# EAGLE design R107S1A (EAGLE 6.6.0)
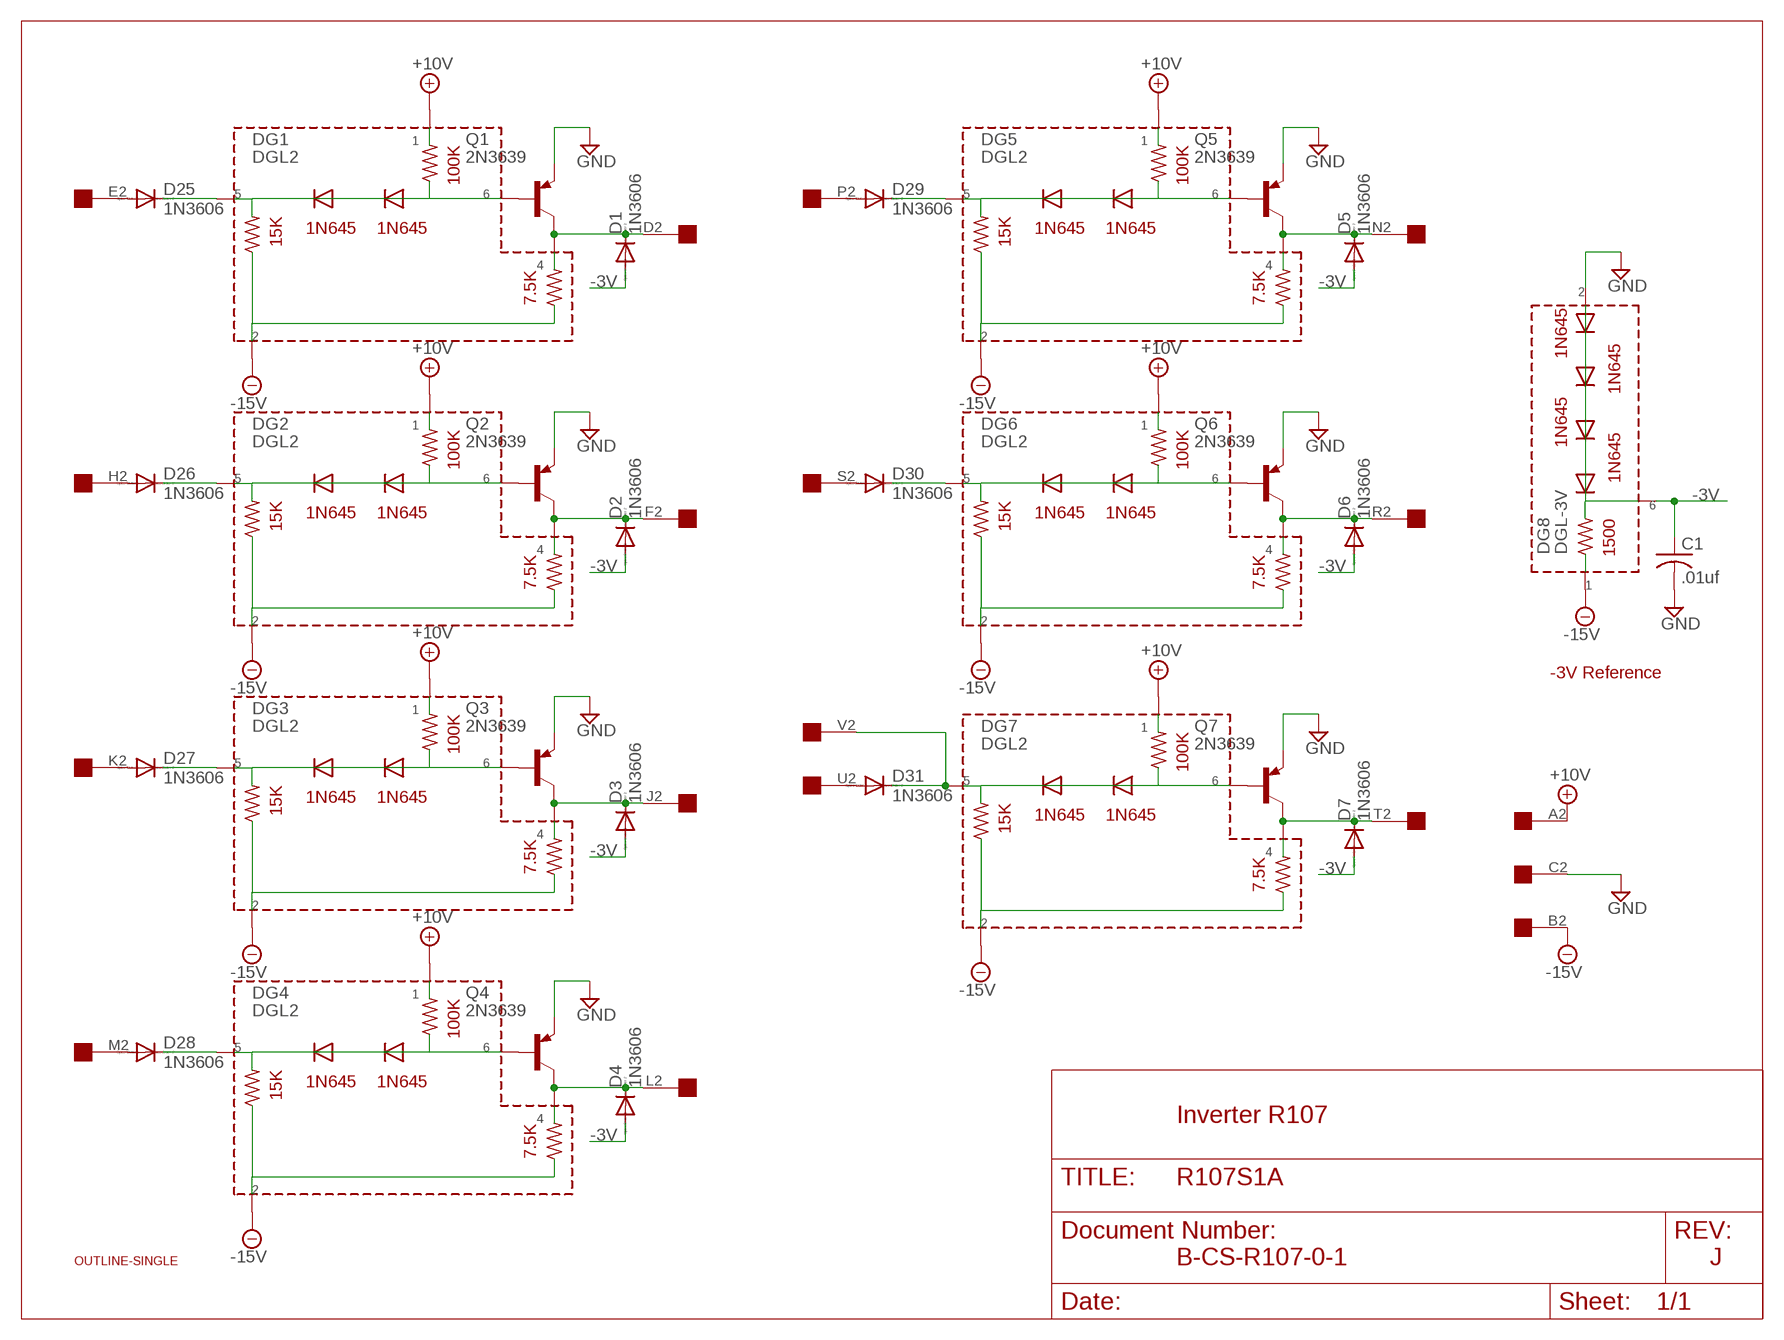
[diagram p0: schematic, sheet 1]

## Parts
C1  .01uf  C-US050-025X075  [C050-025X075]
D1  1N3606  1N4148DO35-10  [DO35-10]
D2  1N3606  1N4148DO35-10  [DO35-10]
D3  1N3606  1N4148DO35-10  [DO35-10]
D4  1N3606  1N4148DO35-10  [DO35-10]
D5  1N3606  1N4148DO35-10  [DO35-10]
D6  1N3606  1N4148DO35-10  [DO35-10]
D7  1N3606  1N4148DO35-10  [DO35-10]
D25  1N3606  1N4148DO35-10  [DO35-10]
D26  1N3606  1N4148DO35-10  [DO35-10]
D27  1N3606  1N4148DO35-10  [DO35-10]
D28  1N3606  1N4148DO35-10  [DO35-10]
D29  1N3606  1N4148DO35-10  [DO35-10]
D30  1N3606  1N4148DO35-10  [DO35-10]
D31  1N3606  1N4148DO35-10  [DO35-10]
DG1  DGL2  [DGL2]
DG2  DGL2  [DGL2]
DG3  DGL2  [DGL2]
DG4  DGL2  [DGL2]
DG5  DGL2  [DGL2]
DG6  DGL2  [DGL2]
DG7  DGL2  [DGL2]
DG8  DGL-3V  [DGL2]
Q1  2N3639  2N3637  [TO39]
Q2  2N3639  2N3637  [TO39]
Q3  2N3639  2N3637  [TO39]
Q4  2N3639  2N3637  [TO39]
Q5  2N3639  2N3637  [TO39]
Q6  2N3639  2N3637  [TO39]
Q7  2N3639  2N3637  [TO39]
U$1  OUTLINE-SINGLE  [SINGLE]
U$2  EDGE-1  [EDGE-CON1]

## Nets
+10V [Power]: DG1.P$1 DG2.P$1 DG3.P$1 DG4.P$1 DG5.P$1 DG6.P$1 DG7.P$1 U$2.A2
-3V [Power]: C1.1 D1.A D2.A D3.A D4.A D5.A D6.A D7.A DG8.P$6
-15V [Power]: DG1.P$2 DG2.P$2 DG3.P$2 DG4.P$2 DG5.P$2 DG6.P$2 DG7.P$2 DG8.P$1 U$2.B2
GND [Power]: C1.2 DG8.P$2 Q1.1(E) Q2.1(E) Q3.1(E) Q4.1(E) Q5.1(E) Q6.1(E) Q7.1(E) U$2.C2
N$1: D7.C DG7.P$4 Q7.3(C) U$2.T2
N$2: DG2.P$6 Q2.2(B)
N$4: D2.C DG2.P$4 Q2.3(C) U$2.F2
N$5: D26.A U$2.H2
N$6: DG3.P$6 Q3.2(B)
N$7: DG4.P$6 Q4.2(B)
N$8: D26.C DG2.P$5
N$9: D3.C DG3.P$4 Q3.3(C) U$2.J2
N$10: D27.A U$2.K2
N$11: D27.C DG3.P$5
N$12: D28.C DG4.P$5
N$14: D31.A U$2.U2
N$15: DG5.P$6 Q5.2(B)
N$17: D31.C DG7.P$5 U$2.V2
N$18: DG6.P$6 Q6.2(B)
N$19: DG1.P$6 Q1.2(B)
N$20: D1.C DG1.P$4 Q1.3(C) U$2.D2
N$21: D25.A U$2.E2
N$22: D25.C DG1.P$5
N$23: DG7.P$6 Q7.2(B)
N$24: D30.C DG6.P$5
N$25: D4.C DG4.P$4 Q4.3(C) U$2.L2
N$26: D28.A U$2.M2
N$30: D5.C DG5.P$4 Q5.3(C) U$2.N2
N$31: D29.A U$2.P2
N$32: D29.C DG5.P$5
N$35: D6.C DG6.P$4 Q6.3(C) U$2.R2
N$36: D30.A U$2.S2

## Notes on the sheet
- -3V Reference
- Inverter R107
- B-CS-R107-0-1 | J

## Library data of the parts
C1 = rcl:C-US: CAPACITOR, American symbol
D1-D7 D25-D31 = diode:1N4148: DIODE high speed (Philips)
DG1-DG7 = dec-con:DGL2: Diode Gate Logic Block
DG8 = dec-con:DGL-3V: -3V Clamp/Reference
Q1-Q7 = transistor-pnp:2N3637*: PNP Transistror
U$1 = dec-con:OUTLINE-*: Board outlines for DEC boards.
U$2 = dec-con:EDGE-1: Single-Sided DEC Edge Connector -- (side 2)

## Net classes
0 default: width 0.406 mm
1 Power: width 0.813 mm

## Board
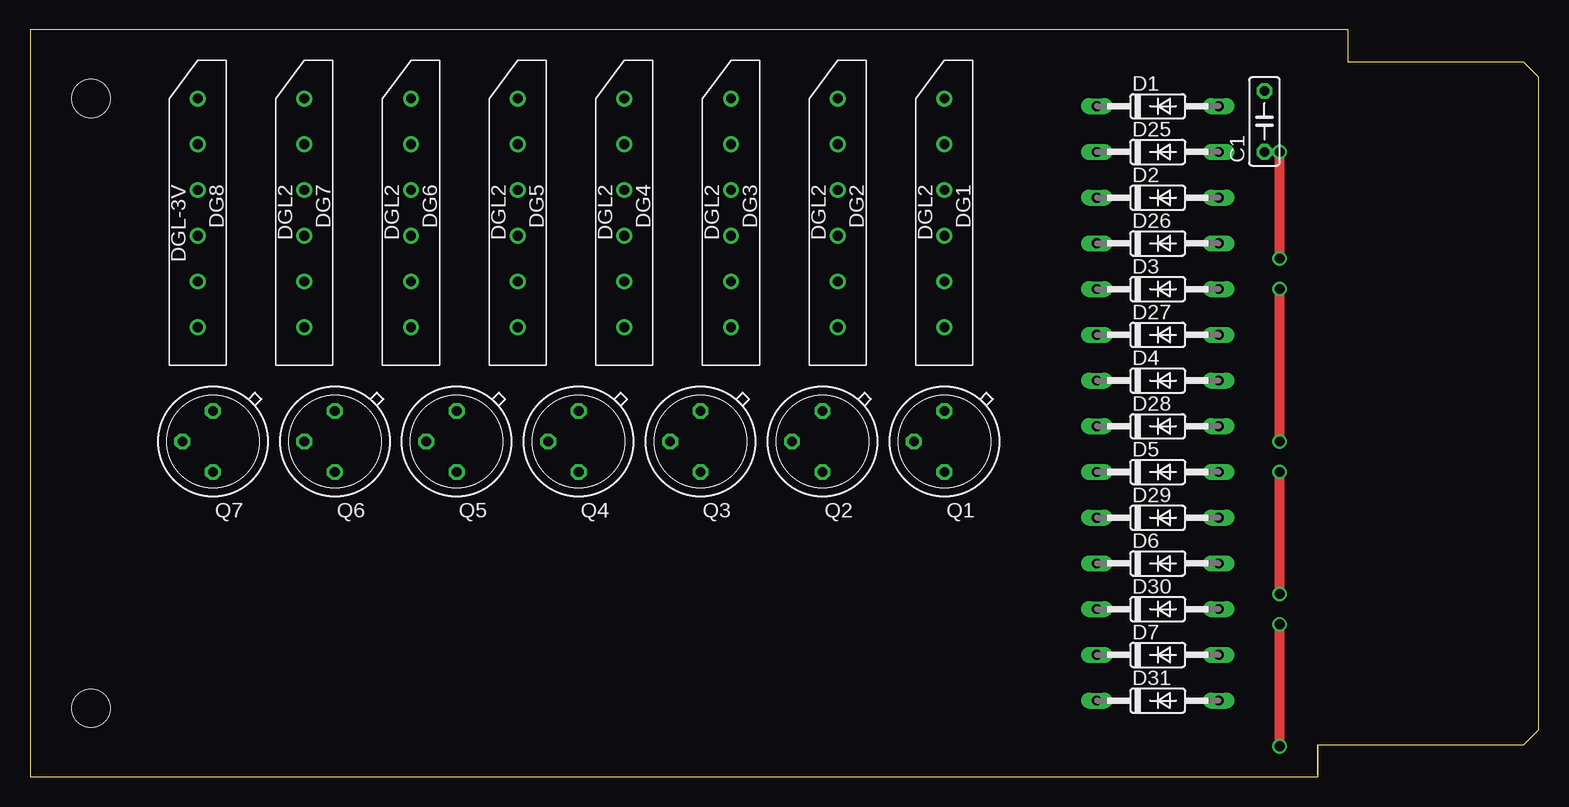
[diagram p1: board, top side]
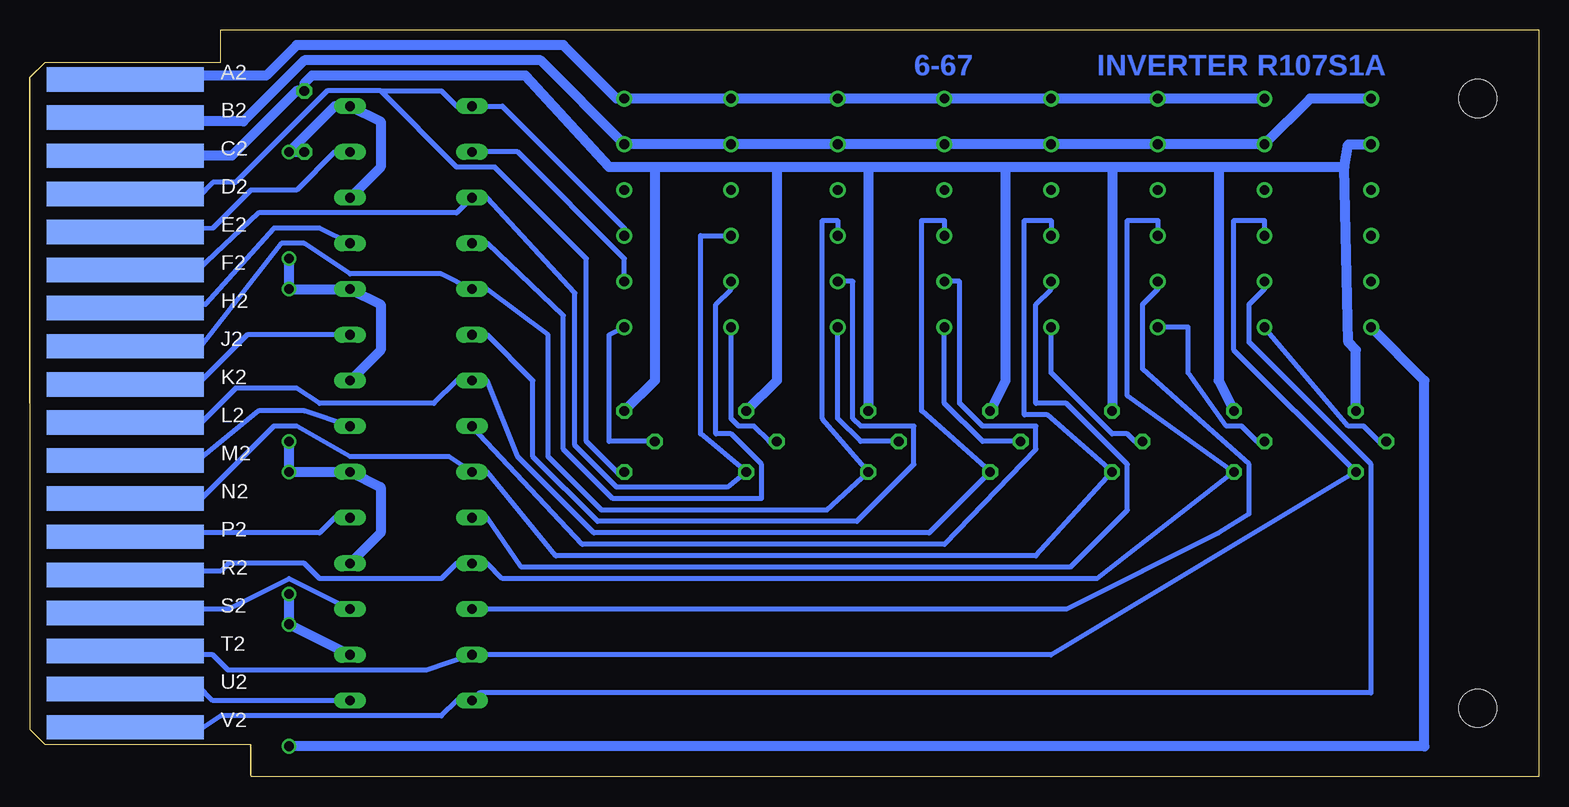
[diagram p2: board, bottom side, seen from below]

Size 125.73 x 62.23 mm. Coordinates in mm from the lower left corner, seen from the top.
Copper layers (1+16): Top 0.035mm / dielectric 1.5mm / Bottom 0.035mm
Design rules "16mils": minimum track width 16mil, minimum drill 32mil, track to track 15mil, track to pad 10mil, pad to pad 10mil, via to via 10mil, smd to smd 10mil, copper to edge 13mil, drill to drill 10mil, minimum pad ring 10mil, minimum via ring 8mil, stop-mask expansion 0mil, vias tented up to drill 0mil, thermal gap 10mil

### Footprints (pad centres in the part's own frame; a part is rotated, then mirrored left to right if it is on the bottom)
C050-025X075 = drill 0.813 octagon: 1 -2.54,0; 2 2.54,0
DO35-10 = drill 0.813 long: A 5.08,0; C -5.08,0
DGL2 = drill 0.813: P$1 -9.525,0; P$2 -5.715,0; P$3 -1.905,0; P$4 1.905,0; P$5 5.715,0; P$6 9.525,0
TO39 = drill 0.813 octagon: 1 0,-2.54; 2 2.54,0; 3 0,2.54
SINGLE = hole 3.175: 120.65,56.515; 120.65,5.715
EDGE-CON1 = smd 13.106 x 2.032 bottom: A2 7.938,4.128; B2 7.938,7.303; C2 7.938,10.477; D2 7.938,13.652; E2 7.938,16.828; F2 7.938,20.003; H2 7.938,23.177; J2 7.938,26.352; K2 7.938,29.527; L2 7.938,32.703; M2 7.938,35.877; N2 7.938,39.053; P2 7.938,42.227; R2 7.938,45.403; S2 7.938,48.578; T2 7.938,51.752; U2 7.938,54.928; V2 7.938,58.102

### Placement (x,y rotation side)
C1  102.87,54.61 90 top
D1  93.98,55.88 0 top
D2  93.98,48.26 0 top
D3  93.98,40.64 0 top
D4  93.98,33.02 0 top
D5  93.98,25.4 0 top
D6  93.98,17.78 0 top
D7  93.98,10.16 0 top
D25  93.98,52.07 0 top
D26  93.98,44.45 0 top
D27  93.98,36.83 0 top
D28  93.98,29.21 0 top
D29  93.98,21.59 0 top
D30  93.98,13.97 0 top
D31  93.98,6.35 0 top
DG1  76.2,46.99 270 top
DG2  67.31,46.99 270 top
DG3  58.42,46.99 270 top
DG4  49.53,46.99 270 top
DG5  40.64,46.99 270 top
DG6  31.75,46.99 270 top
DG7  22.86,46.99 270 top
DG8  13.97,46.99 270 top
Q1  76.2,27.94 180 top
Q2  66.04,27.94 180 top
Q3  55.88,27.94 180 top
Q4  45.72,27.94 180 top
Q5  35.56,27.94 180 top
Q6  25.4,27.94 180 top
Q7  15.24,27.94 180 top
U$1  125.73,62.23 180 top
U$2  125.73,62.23 180 top

### Tracks (layer width: path | path; a pad name or v marks a point on that pad's centre or on a via)
+10V
  Bottom 0.813: U$2.A2 111.76,58.42 106.05,58.42 103.5,60.96 81.28,60.96 76.83,56.52 DG1.P$1 DG2.P$1 DG3.P$1 DG4.P$1 DG5.P$1 DG6.P$1 DG7.P$1
-3V  (via drill 0.81)
  Top 0.813: v104.14,2.54 v104.14,12.7 | v104.14,15.24 v104.14,25.4 | v104.14,27.94 v104.14,40.64 | v104.14,43.18 v104.14,52.07
  Bottom 0.813: v104.14,15.24 v104.14,12.7 D7.A | v104.14,27.94 v104.14,25.4 D5.A 96.52,24.13 96.52,20.32 D6.A | v104.14,43.18 v104.14,40.64 D3.A 96.52,39.37 96.52,35.56 D4.A | D2.A 96.52,50.8 96.52,54.61 D1.A 100.33,55.88 v104.14,52.07 C1.1 | DG8.P$6 9.53,33.02 9.53,2.54 v104.14,2.54
-15V
  Bottom 0.813: U$2.B2 113.03,54.61 107.95,54.61 102.87,59.69 83.19,59.69 DG1.P$2 DG2.P$2 DG3.P$2 DG4.P$2 DG5.P$2 DG6.P$2 DG7.P$2 19.05,56.52 DG8.P$1
GND
  Bottom 0.813: U$2.C2 108.9,51.75 103.5,57.15 C1.2 102.87,57.78 102.23,58.42 84.45,58.42 77.47,50.8 73.66,50.8 | 16.19,50.8 15.88,36.2 15.24,35.56 Q7.1 | 16.19,50.8 15.88,52.7 DG8.P$2 | 16.19,50.8 26.67,50.8 | 26.67,50.8 35.56,50.8 | 35.56,50.8 44.45,50.8 | 44.45,50.8 55.88,50.8 | 55.88,50.8 63.5,50.8 | 63.5,50.8 73.66,50.8 | Q6.1 26.67,33.02 26.67,50.8 | 35.56,50.8 Q5.1 | 44.45,50.8 44.45,33.02 Q4.1 | Q1.1 73.66,33.02 73.66,50.8 | Q2.1 63.5,33.02 63.5,50.8 | 55.88,50.8 Q3.1
N$1
  Bottom 0.406: U$2.T2 111.76,10.16 110.49,10.16 109.22,8.89 92.71,8.89 D7.C 40.64,10.16 Q7.3 25.4,35.56 25.4,46.35 22.86,46.35 DG7.P$4
N$2
  Bottom 0.406: Q2.2 64.14,27.94 65.41,29.21 66.67,29.21 67.31,29.84 DG2.P$6
N$4
  Bottom 0.406: U$2.F2 111.76,42.23 106.68,46.99 90.17,46.99 D2.C 87.63,48.26 80.33,40.32 80.33,27.62 76.83,24.13 67.63,24.13 Q2.3 69.85,28.57 69.85,45.09 DG2.P$4
N$5
  Bottom 0.406: D26.A 101.6,45.72 105.41,45.72 111.12,39.37 112.39,39.37 U$2.H2
N$6
  Bottom 0.406: Q3.2 56.52,27.94 58.42,29.84 DG3.P$6
N$7
  Bottom 0.406: Q4.2 46.35,27.94 49.53,31.11 DG4.P$6
N$8
  Bottom 0.406: DG2.P$5 67.31,40.64 68.58,39.37 68.58,28.57 67.31,28.57 64.77,26.04 64.77,23.18 77.15,23.18 81.28,27.3 81.28,38.42 87.63,44.45 D26.C
N$9
  Bottom 0.406: U$2.J2 112.39,35.56 111.76,35.56 104.78,44.45 102.87,44.45 99.06,41.91 91.44,41.91 D3.C 87.63,40.64 82.55,36.83 82.55,26.67 78.11,22.23 59.37,22.23 Q3.3 59.69,29.84 59.69,46.35 58.42,46.35 DG3.P$4
N$10
  Bottom 0.406: D27.A 107.63,36.83 111.44,33.02 U$2.K2
N$11
  Bottom 0.406: D27.C 87.63,36.83 83.82,33.02 83.82,26.67 78.42,21.27 56.83,21.27 52.07,26.04 52.07,29.21 56.52,29.21 57.15,29.84 57.15,41.27 DG3.P$5
N$12
  Bottom 0.406: D28.C 79.69,19.37 49.53,19.37 41.91,27.3 41.91,29.21 46.35,29.21 48.26,31.11 48.26,41.27 DG4.P$5
N$14
  Bottom 0.406: D31.A 110.49,6.35 111.76,7.62 U$2.U2
N$15
  Bottom 0.406: Q5.2 33.66,27.94 34.29,28.57 35.56,28.57 40.64,33.66 DG5.P$6
N$17
  Bottom 0.406: U$2.V2 111.76,3.81 109.86,5.08 91.44,5.08 90.17,6.35 D31.C 88.27,6.99 13.97,6.99 13.97,26.04 24.13,36.2 24.13,39.37 22.86,40.64 DG7.P$5
N$18
  Bottom 0.406: Q6.2 23.5,27.94 24.77,29.21 26.04,29.21 29.21,33.66 29.21,37.47 DG6.P$6
N$19
  Bottom 0.406: Q1.2 77.47,27.94 77.47,36.83 DG1.P$6
N$20
  Bottom 0.406: 96.52,57.15 91.44,57.15 90.17,55.88 D1.C 86.36,55.88 76.2,45.72 DG1.P$4 | 96.52,57.15 100.97,57.15 108.58,49.53 110.49,49.53 111.76,48.26 113.03,48.26 U$2.D2 | 96.52,57.15 90.17,50.8 87,50.8 79.38,43.18 79.38,27.94 76.83,25.4 Q1.3
N$21
  Bottom 0.406: D25.A 100.33,52.07 103.5,48.9 107.31,48.9 110.49,45.72 U$2.E2
N$22
  Bottom 0.406: DG1.P$5 76.2,43.18 85.09,52.07 D25.C
N$23
  Bottom 0.406: DG7.P$6 15.88,29.21 14.61,29.21 13.34,27.94 Q7.2
N$24
  Bottom 0.406: DG6.P$5 31.75,40.64 33.02,39.37 33.02,33.97 30.16,31.43 24.13,26.04 24.13,21.91 26.67,20.32 39.37,13.97 D30.C
N$25
  Bottom 0.406: U$2.L2 111.76,29.21 108.58,32.38 103.5,32.38 101.6,31.11 92.08,31.11 90.17,33.02 D4.C 87.63,33.02 85.09,26.67 78.74,20.32 50.8,20.32 Q4.3 51.44,30.48 51.44,46.35 49.53,46.35 DG4.P$4
N$26
  Bottom 0.406: D28.A 102.87,30.48 106.68,30.48 111.76,26.35 U$2.M2
N$30
  Bottom 0.406: U$2.N2 111.76,22.86 105.41,29.21 103.5,29.21 99.06,26.67 90.81,26.67 D5.C 87.63,25.4 81.92,18.41 41.91,18.41 Q5.3 40.96,30.16 42.86,30.16 42.86,46.35 40.64,46.35 DG5.P$4
N$31
  Bottom 0.406: D29.A 100.33,21.59 101.6,20.32 112.39,20.32 U$2.P2
N$32
  Bottom 0.406: DG5.P$5 40.64,40.64 41.91,39.37 41.91,31.11 39.37,31.11 34.29,26.04 34.29,22.23 39.05,17.46 84.77,17.46 87.63,21.59 D29.C
N$35
  Bottom 0.406: DG6.P$4 31.75,46.35 34.29,46.35 34.29,31.75 25.42,25.37 Q6.3 36.83,16.51 86.36,16.51 87.63,17.78 D6.C 90.17,17.78 91.44,16.51 101.6,16.51 102.87,17.78 109.22,17.78 109.86,17.14 111.76,17.14 U$2.R2
N$36
  Bottom 0.406: D30.A 104.14,16.51 109.22,13.97 111.76,13.97 U$2.S2

### Text on the board
Bottom: INVERTER R107S1A | 6-67